# EAGLE schematic Hardware_Schematic (EAGLE 7.2.0)
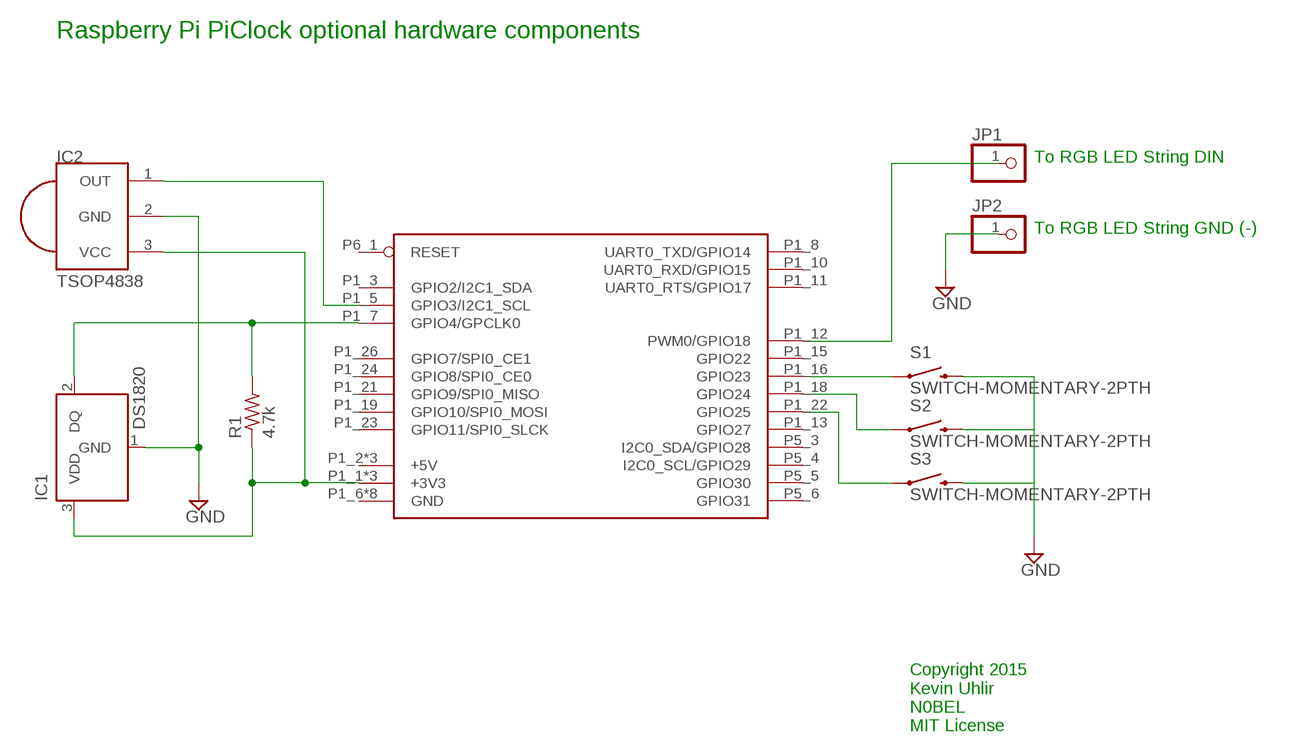
[diagram p0: schematic, sheet 1]

## Parts
IC1  DS1820  [TO-92]
IC2  TSOP4838  PNA460XM  [PNA460XM]
JP1  PINHD-1X1  [1X01]
JP2  PINHD-1X1  [1X01]
R1  4.7k  R-US_VMTA55  [VMTA55]
S1  SWITCH-MOMENTARY-2PTH  [TACTILE-PTH]
S2  SWITCH-MOMENTARY-2PTH  [TACTILE-PTH]
S3  SWITCH-MOMENTARY-2PTH  [TACTILE-PTH]
U$1  RPI-B-V2  [RPI-A-SHIELD]

## Nets
GND: IC1.1(GND) IC2.2(GND) JP2.1 S1.3 S2.3 S3.3
N$1: IC1.3(VDD) IC2.3(VCC) R1.1 U$1.P1_1(+3V3) U$1.P1_17(+3V3) U$1.P5_2(+3V3)
N$2: IC1.2(DQ) R1.2 U$1.P1_7(GPIO4/GPCLK0)
N$3: IC2.1(OUT) U$1.P1_5(GPIO3/I2C1_SCL)
N$4: S1.1 U$1.P1_16(GPIO23)
N$5: S2.1 U$1.P1_18(GPIO24)
N$6: S3.1 U$1.P1_22(GPIO25)
N$8: JP1.1 U$1.P1_12(PWM0/GPIO18)
Unconnected: U$1.P1_3(GPIO2/I2C1_SDA) U$1.P1_8(UART0_TXD/GPIO14) U$1.P1_10(UART0_RXD/GPIO15) U$1.P1_11(UART0_RTS/GPIO17) U$1.P1_13(GPIO27) U$1.P1_15(GPIO22) U$1.P1_19(GPIO10/SPI0_MOSI) U$1.P1_21(GPIO9/SPI0_MISO) U$1.P1_23(GPIO11/SPI0_SLCK) U$1.P1_24(GPIO8/SPI0_CE0) U$1.P1_26(GPIO7/SPI0_CE1)

## Notes on the sheet
- Raspberry Pi PiClock optional hardware components
- To RGB LED String DIN
- To RGB LED String GND (-)
- Copyright 2015
  Kevin Uhlir
  N0BEL
  MIT License

## Power pins joined to a net without a drawn wire
+5V: U$1.P1_2(+5V) U$1.P1_4(+5V) U$1.P5_1(+5V)
GND: U$1.P1_6(GND) U$1.P1_9(GND) U$1.P1_14(GND) U$1.P1_20(GND) U$1.P1_25(GND) U$1.P5_7(GND) U$1.P5_8(GND) U$1.P6_2(GND)
GPIO30: U$1.P5_5(GPIO30)
GPIO31: U$1.P5_6(GPIO31)
I2C0_SCL/GPIO29: U$1.P5_4(I2C0_SCL/GPIO29)
I2C0_SDA/GPIO28: U$1.P5_3(I2C0_SDA/GPIO28)
RESET: U$1.P6_1(RESET)

## Library data of the parts
IC1 = DS1820:DS1820: DS1820 - 1-Wire Digital Thermometer
IC2 = adafruit:PNA460XM: IR 38KHz receiver PNA4602 and related receivers http://www.ladyada.net/library/pcb/eaglelibrary.html
JP1 JP2 = adafruit:PINHD-1X1: Pin header 1x1 for 0.1" spacing With round pins
R1 = resistor:R-US_: RESISTOR, American symbol
S1-S3 = SparkFun-Electromechanical:SWITCH-MOMENTARY-2: Various NO switches- pushbuttons, reed, etc; PROD_ID: SWCH-08441
U$1 = raspberry:RPI-B-V2: Second revision of the Model 2 board including the P5 and P6 headers. Mounting holes have been added. Choose the "SHIELD" variant for a predefined Dimension layer and drilling holes. Theres also a "SHIELD" variant for the Model A without a RJ45 connector.